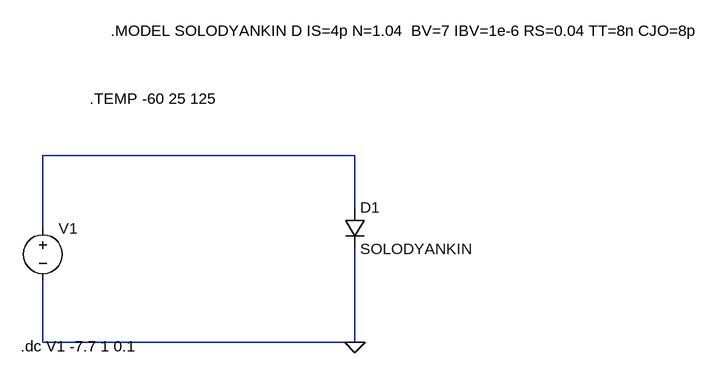
[diagram p0: schematic Draft1_1.asc]
Draft1_1.asc, the LTspice schematic file:
Version 4
SHEET 1 1124 680
WIRE 384 224 -96 224
WIRE 384 304 384 224
WIRE -96 336 -96 224
WIRE -96 512 -96 416
WIRE 384 512 384 368
WIRE 384 512 -96 512
FLAG 384 512 0
SYMBOL diode 368 304 R0
SYMATTR InstName D1
SYMATTR Value SOLODYANKIN
SYMBOL voltage -96 320 R0
WINDOW 123 0 0 Left 2
WINDOW 39 0 0 Left 2
SYMATTR InstName V1
SYMATTR Value ""
TEXT 8 32 Left 2 !.MODEL SOLODYANKIN D IS=4p N=1.04  BV=7 IBV=1e-6 RS=0.04 TT=8n CJO=8p
TEXT -130 518 Left 2 !.dc V1 -7.7 1 0.1
TEXT -24 136 Left 2 !.TEMP -60 25 125

The netlist it stands for:
* Draft1_1.asc
D1 N001 0 SOLODYANKIN
V1 N001 0
.model D D
.lib standard.dio
.MODEL SOLODYANKIN D IS=4p N=1.04  BV=7 IBV=1e-6 RS=0.04 TT=8n CJO=8p
.dc V1 -7.7 1 0.1
.TEMP -60 25 125
.backanno
.end